# Altium schematic sheet 03_power.SchDoc
size A3
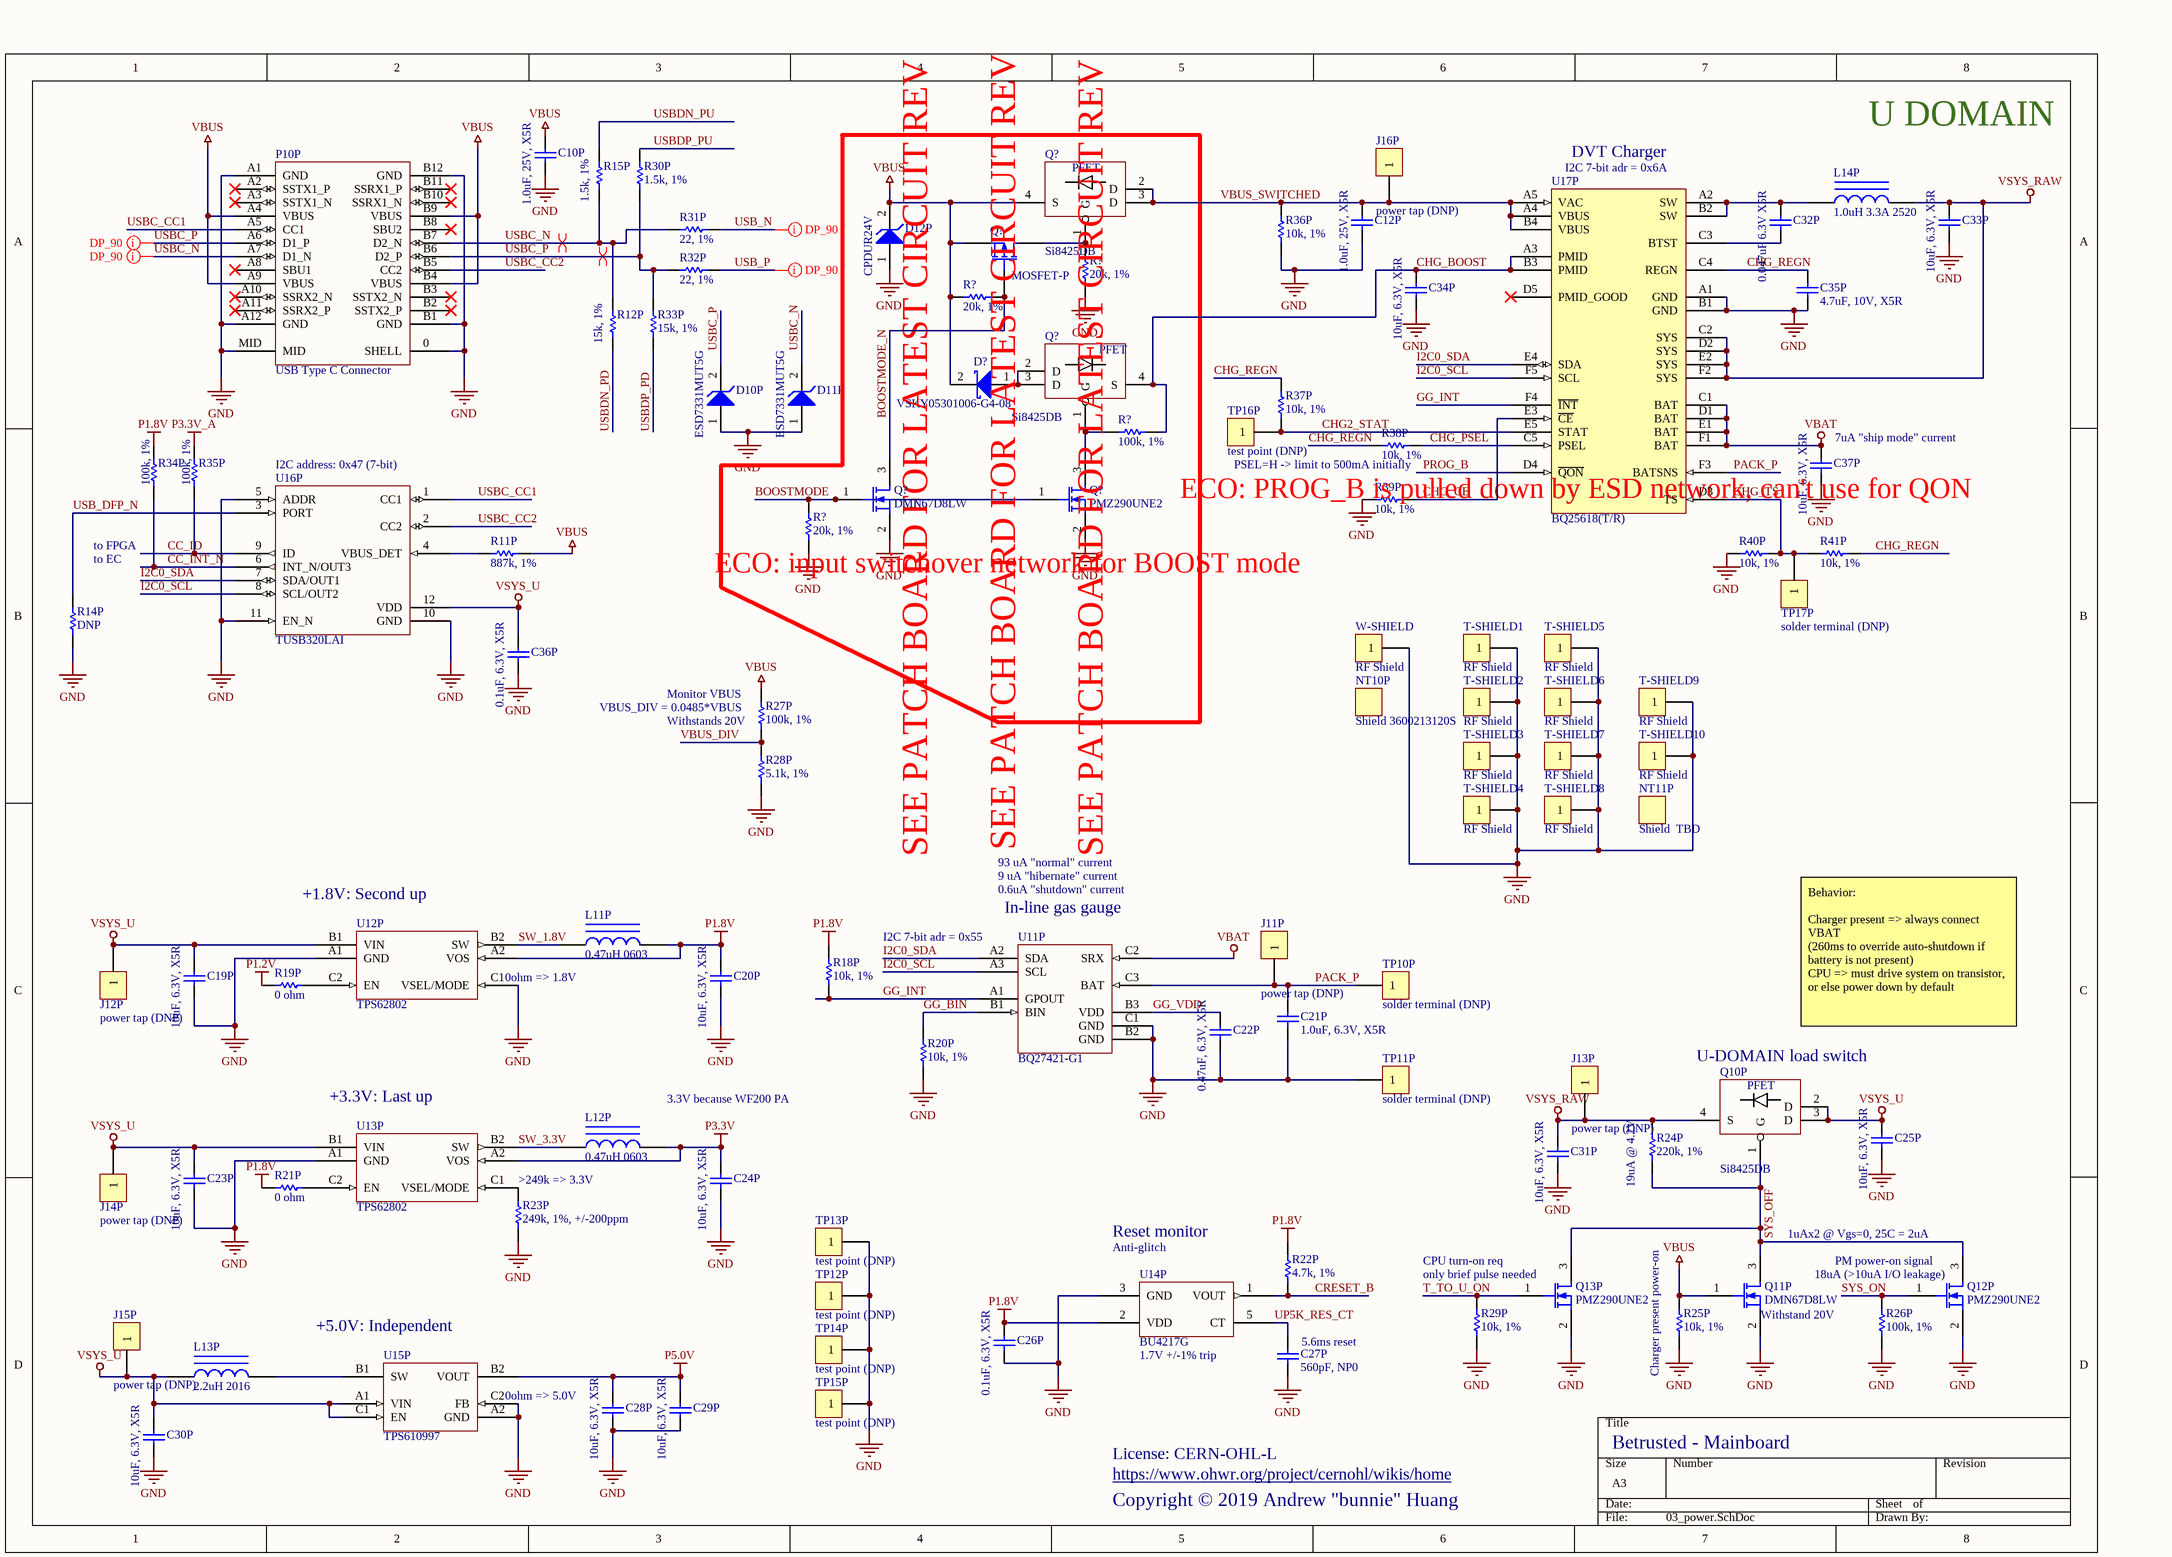
[diagram p0: 03_power.SchDoc]

## Parts
(Parts that share a designator on the sheet are numbered #1, #2 ... from top to bottom, then left to right.)
C10P  1.0uF, 25V, X5R  [B_CAP0603]
C12P  1.0uF, 25V, X5R  [B_CAP0603]
C19P  10uF, 6.3V, X5R  [B_CAP0603]
C20P  10uF, 6.3V, X5R  [B_CAP0603]
C21P  1.0uF, 6.3V, X5R  [B_CAP0201]
C22P  0.47uF, 6.3V, X5R  [B_CAP0201]
C23P  10uF, 6.3V, X5R  [B_CAP0603]
C24P  10uF, 6.3V, X5R  [B_CAP0603]
C25P  10uF, 6.3V, X5R  [B_CAP0603]
C26P  0.1uF, 6.3V, X5R  [B_CAP0201]
C27P  560pF, NP0  [B_RES0201]
C28P  10uF, 6.3V, X5R  [B_CAP0603]
C29P  10uF, 6.3V, X5R  [B_CAP0603]
C30P  10uF, 6.3V, X5R  [B_CAP0603]
C31P  10uF, 6.3V, X5R  [B_CAP0603]
C32P  0.047uF 6.3V X5R  [B_CAP0201]
C33P  10uF, 6.3V, X5R  [B_CAP0603]
C34P  10uF, 6.3V, X5R  [B_CAP0603]
C35P  4.7uF, 10V, X5R  [B_CAP0603]
C36P  0.1uF, 6.3V, X5R  [B_CAP0201]
C37P  10uF, 6.3V, X5R  [B_CAP0603]
D10P  ESD7331MUT5G  [D_X3DFN2_0201]
D11P  ESD7331MUT5G  [D_X3DFN2_0201]
D12P  CPDUR24V  [SOD523]
D?  VSKY05301006-G4-08  [B_DIO0402]
J11P  power tap (DNP)  [RESTAP-0603]
J12P  power tap (DNP)  [RESTAP-0603]
J13P  power tap (DNP)  [RESTAP-0603]
J14P  power tap (DNP)  [RESTAP-0603]
J15P  power tap (DNP)  [RESTAP-0603]
J16P  power tap (DNP)  [RESTAP-0603]
L11P  0.47uH 0603  [B_IND0603]
L12P  0.47uH 0603  [B_IND0603]
L13P  2.2uH 2016  [B_IND2016_TDK]
L14P  1.0uH 3.3A 2520  [B_IND2025_SAM]
NT10P  Shield 3600213120S
NT11P  Shield  TBD
P10P  USB Type C Connector  [TE_1-2295018-2]
Q10P  Si8425DB  [VISHAY_MICRO_FOOT_4_BUMP]
Q11P  DMN67D8LW  [SOT323-3AN]
Q12P  PMZ290UNE2  [SOT883]
Q13P  PMZ290UNE2  [SOT883]
Q?#1  Si8425DB  [VISHAY_MICRO_FOOT_4_BUMP]
Q?#2  MOSFET-P  [E3]
Q?#3  Si8425DB  [VISHAY_MICRO_FOOT_4_BUMP]
Q?#4  DMN67D8LW  [SOT323-3AN]
Q?#5  PMZ290UNE2  [SOT883]
R11P  887k, 1%  [B_RES0201]
R12P  15k, 1%  [B_RES0201]
R14P  DNP  [B_RES0201]
R15P  1.5k, 1%  [B_RES0201]
R18P  10k, 1%  [B_RES0201]
R19P  0 ohm  [B_RES0201]
R20P  10k, 1%  [B_RES0201]
R21P  0 ohm  [B_RES0201]
R22P  4.7k, 1%  [B_RES0201]
R23P  249k, 1%, +/-200ppm  [B_RES0402]
R24P  220k, 1%  [B_RES0201]
R25P  10k, 1%  [B_RES0201]
R26P  100k, 1%  [B_RES0201]
R27P  100k, 1%  [B_RES0201]
R28P  5.1k, 1%  [B_RES0201]
R29P  10k, 1%  [B_RES0201]
R30P  1.5k, 1%  [B_RES0201]
R31P  22, 1%  [B_RES0201]
R32P  22, 1%  [B_RES0201]
R33P  15k, 1%  [B_RES0201]
R34P  100k, 1%  [B_RES0201]
R35P  100k, 1%  [B_RES0201]
R36P  10k, 1%  [B_RES0201]
R37P  10k, 1%  [B_RES0201]
R38P  10k, 1%  [B_RES0201]
R39P  10k, 1%  [B_RES0201]
R40P  10k, 1%  [B_RES0201]
R41P  10k, 1%  [B_RES0201]
R?#1  20k, 1%  [B_RES0201]
R?#2  20k, 1%  [B_RES0201]
R?#3  100k, 1%  [B_RES0201]
R?#4  20k, 1%  [B_RES0201]
T-SHIELD1  RF Shield  [WURTH_36900000]
T-SHIELD2  RF Shield  [WURTH_36900000]
T-SHIELD3  RF Shield  [WURTH_36900000]
T-SHIELD4  RF Shield  [WURTH_36900000]
T-SHIELD5  RF Shield  [WURTH_36900000]
T-SHIELD6  RF Shield  [WURTH_36900000]
T-SHIELD7  RF Shield  [WURTH_36900000]
T-SHIELD8  RF Shield  [WURTH_36900000]
T-SHIELD9  RF Shield  [WURTH_36900000]
T-SHIELD10  RF Shield  [WURTH_36900000]
TP10P  solder terminal (DNP)  [55-MIL-HOLE]
TP11P  solder terminal (DNP)  [55-MIL-HOLE]
TP12P  test point (DNP)  [TP_2MM_SQ]
TP13P  test point (DNP)  [TP_2MM_SQ]
TP14P  test point (DNP)  [TP_2MM_SQ]
TP15P  test point (DNP)  [TP_2MM_SQ]
TP16P  test point (DNP)  [TP_2MM_SQ]
TP17P  solder terminal (DNP)  [55-MIL-HOLE]
U11P  BQ27421-G1  [BGA9C50P3X3_162X158X62]
U12P  TPS62802  [BGA6C35P2X3_70X105X40_NSMD]
U13P  TPS62802  [BGA6C35P2X3_70X105X40_NSMD]
U14P  BU4217G  [SOT23-5AN]
U15P  TPS610997  [BGA6C40P2X3_88X123X62]
U16P  TUSB320LAI  [QFN40P160X160X40-12N]
U17P  BQ25618(T/R)  [BGA30C40P5X6_196X236X62]
W-SHIELD  RF Shield  [WURTH_36X021312XS]

## Blocks framed on the sheet
ECO: PROG_B is pulled down by ESD network, can't use for QON: D12P D? Q?#1-Q?#5 R?#1-R?#4

## Nets
GND: C10P.2 C12P.2 C19P.2 C20P.2 C21P.1 C22P.2 C23P.2 C24P.2 C25P.2 C26P.2 C27P.2 C28P.2 C29P.2 C30P.2 C31P.2 C33P.2 C34P.2 C35P.1 C36P.2 C37P.2 D10P.1(A) D11P.1(A) D12P.1(A) P10P.0(SHELL) P10P.A1(GND) P10P.A12(GND) P10P.B1(GND) P10P.B12(GND) P10P.MID Q11P.2(S) Q12P.2(S) Q13P.2(S) Q?#4.2(S) Q?#5.2(S) R14P.2 R20P.2 R23P.2 R25P.2 R26P.1 R28P.2 R29P.2 R36P.1 R39P.1 R40P.1 R?#1.1 R?#4.1 T-SHIELD1.1 T-SHIELD2.1 T-SHIELD3.1 T-SHIELD4.1 T-SHIELD5.1 T-SHIELD6.1 T-SHIELD7.1 T-SHIELD8.1 T-SHIELD9.1 T-SHIELD10.1 TP11P.1 TP12P.1 TP13P.1 TP14P.1 TP15P.1 U11P.B2(GND) U11P.C1(GND) U12P.A1(GND) U12P.C1(VSEL/MODE) U13P.A1(GND) U14P.3(GND) U15P.A2(GND) U15P.C2(FB) U16P.5(ADDR) U16P.10(GND) U16P.11(EN_N) U17P.A1(GND) U17P.B1(GND) W-SHIELD.1
P1.2V: R19P.1
P1.8V: C20P.1 C26P.1 L11P.2 R18P.1 R21P.1 R22P.2 R34P.2 U12P.A2(VOS) U14P.2(VDD)
P3.3V: C24P.1 L12P.2 U13P.A2(VOS)
P3.3V_A: R35P.2
P5.0V: C28P.1 C29P.1 U15P.B2(VOUT)
VBAT: C37P.1 U11P.C2(SRX) U17P.C1(BAT) U17P.D1(BAT) U17P.E1(BAT) U17P.F1(BAT)
VBUS: C10P.1 D12P.2(K) D?.2(K) P10P.A4(VBUS) P10P.A9(VBUS) P10P.B4(VBUS) P10P.B9(VBUS) Q11P.1(G) Q?#1.4(S) Q?#2.3(S) R11P.1 R25P.1 R27P.2 R?#2.2
VSYS_RAW: C31P.1 C33P.1 J13P.1 L14P.2 Q10P.4(S) R24P.2 U17P.C2(SYS) U17P.D2(SYS) U17P.E2(SYS) U17P.F2(SYS)
VSYS_U: C19P.1 C23P.1 C25P.1 C30P.1 C36P.1 J12P.1 J14P.1 J15P.1 L13P.1 Q10P.2(D) Q10P.3(D) U12P.B1(VIN) U13P.B1(VIN) U15P.A1(VIN) U15P.C1(EN) U16P.12(VDD)
BOOSTMODE: Q?#4.1(G) Q?#5.1(G) R?#4.2
BOOSTMODE_N: Q?#2.2(G) Q?#4.3(D) R?#2.1
CC_ID: R35P.1 U16P.9(ID)
CC_INT_N: R34P.1 U16P.6(INT_N/OUT3)
CHG2_STAT: R37P.2 TP16P.1 U17P.E5(STAT)
CHG_BOOST: C34P.1 Q?#3.4(S) R?#3.1 U17P.A3(PMID) U17P.B3(PMID)
CHG_CE: R39P.2 U17P.E3(~{CE})
CHG_PSEL: R38P.2 U17P.C5(PSEL)
CHG_REGN: C35P.2 R37P.1 R38P.1 R41P.2 U17P.C4(REGN)
CHG_TS: R40P.2 R41P.1 TP17P.1 U17P.D3(TS)
CRESET_B: R22P.1 U14P.1(VOUT)
GG_BIN: R20P.1 U11P.B1(BIN)
GG_INT: R18P.2 U11P.A1(GPOUT) U17P.F4(~{INT})
GG_VDD: C22P.1 U11P.B3(VDD)
I2C0_SCL: U11P.A3(SCL) U16P.8(SCL/OUT2) U17P.F5(SCL)
I2C0_SDA: U11P.A2(SDA) U16P.7(SDA/OUT1) U17P.E4(SDA)
PACK_P: C21P.2 J11P.1 TP10P.1 U11P.C3(BAT) U17P.F3(BATSNS)
PROG_B: U17P.D4(~{QON})
SW_1.8V: L11P.1 U12P.B2(SW)
SW_3.3V: L12P.1 U13P.B2(SW)
SYS_OFF: Q10P.1(G) Q11P.3(D) Q12P.3(D) Q13P.3(D) R24P.1
SYS_ON: Q12P.1(G) R26P.2
T_TO_U_ON: Q13P.1(G) R29P.1
UP5K_RES_CT: C27P.1 U14P.5(CT)
USB_DFP_N: R14P.1 U16P.3(PORT)
USB_N: R31P.2
USB_P: R32P.2
USBC_CC1: P10P.A5(CC1) U16P.1(CC1)
USBC_CC2: P10P.B5(CC2) U16P.2(CC2)
USBC_N: D11P.2(K) P10P.A7(D1_N) P10P.B7(D2_N) R12P.1 R15P.1 R31P.1
USBC_P: D10P.2(K) P10P.A6(D1_P) P10P.B6(D2_P) R30P.1 R32P.1 R33P.1
USBDN_PD: R12P.2
USBDN_PU: R15P.2
USBDP_PD: R33P.2
USBDP_PU: R30P.2
VBUS_DIV: R27P.1 R28P.1
VBUS_SWITCHED: C12P.1 J16P.1 Q?#1.2(D) Q?#1.3(D) R36P.2 U17P.A4(VBUS) U17P.A5(VAC) U17P.B4(VBUS)
NetC32P_1: C32P.1 L14P.1 U17P.A2(SW) U17P.B2(SW)
NetC32P_2: C32P.2 U17P.C3(BTST)
NetD?_1: D?.1(A) Q?#3.2(D) Q?#3.3(D)
NetL13P_2: L13P.2 U15P.B1(SW)
NetQ?#1_1: Q?#1.1(G) Q?#2.1(D) R?#1.2
NetQ?#3_1: Q?#3.1(G) Q?#5.3(D) R?#3.2
NetR11P_2: R11P.2 U16P.4(VBUS_DET)
NetR19P_2: R19P.2 U12P.C2(EN)
NetR21P_2: R21P.2 U13P.C2(EN)
NetR23P_1: R23P.1 U13P.C1(VSEL/MODE)

Not connected (* = marked no-connect by the designer): P10P A2(SSTX1_P)* A3(SSTX1_N)* A8(SBU1)* A10(SSRX2_N)* A11(SSRX2_P)* B2(SSTX2_P)* B3(SSTX2_N)* B8(SBU2)* B10(SSRX1_N)* B11(SSRX1_P)*; U17P D5(PMID_GOOD)*

## Layout directives
differential pair: USBC_N, USBC_P
net class DP_90: USB_N, USB_P, USBC_N, USBC_P

## Notes on the sheet
- (near U17P) DVT Charger
- U DOMAIN
- (near U17P) I2C 7-bit adr = 0x6A
- (near U16P) I2C address: 0x47 (7-bit)
- (near R38P) PSEL=H -> limit to 500mA initially
- (near C37P) 7uA "ship mode" current
- (near R14P) to EC
- to FPGA
- (near R?#4) ECO: input switchover network for BOOST mode
- (near R27P) Monitor VBUS
- (near R27P) VBUS_DIV = 0.0485*VBUS
- (near R27P) Withstands 20V
- (near U12P) +1.8V: Second up
- SEE PATCH BOARD FOR LATEST CIRCUIT REV
- 93 uA "normal" current
- 0.6uA "shutdown" current
- 9 uA "hibernate" current
- (near Q?#1) SEE PATCH BOARD FOR LATEST CIRCUIT REV
- (near U11P) I2C 7-bit adr = 0x55
- (near U11P) In-line gas gauge
- 0ohm => 1.8V
- Behavior:
  Charger present => always connect VBAT
  (260ms to override auto-shutdown if battery is not present)
  CPU => must drive system on transistor, or else power down by default
- (near U13P) +3.3V: Last up
- 3.3V because WF200 PA
- (near Q10P) U-DOMAIN load switch
- (near R23P) >249k => 3.3V
- Reset monitor
- (near R24P) 19uA @ 4.2V
- 1uAx2 @ Vgs=0, 25C = 2uA
- (near U14P) Anti-glitch
- CPU turn-on req
- (near Q13P) only brief pulse needed
- (near Q12P) 18uA (>10uA I/O leakage)
- (near Q12P) PM power-on signal
- (near U15P) +5.0V: Independent
- (near U14P) 1.7V +/-1% trip
- (near C27P) 5.6ms reset
- (near R25P) Charger present power-on
- (near Q11P) Withstand 20V
- 0ohm => 5.0V
- License: CERN-OHL-L
- Copyright © 2019 Andrew "bunnie" Huang
- https://www.ohwr.org/project/cernohl/wikis/home
- Betrusted - Mainboard
- (in symbol Si8425DB) PFET

## Library data of the parts
C10P C12P = Cap Semi: Capacitor (Semiconductor SIM Model); MPN: CL10A105KA8NNNC; VENDOR: Samsung; MYPN: C-105-25-X5R-0603
C19P C20P C23P C24P C25P C28P C29P C30P C31P C33P C34P C37P = Cap Semi: Capacitor (Semiconductor SIM Model); MPN: CL10A106MQ8NNNC; VENDOR: Samsung; MYPN: C-106-6.3-X5R-0603
C21P = Cap Semi: Capacitor (Semiconductor SIM Model); MPN: GRM033R60J105MEA2D; VENDOR: Murata; MYPN: C-105-6p3-X5R-0201
C22P = Cap Semi: Capacitor (Semiconductor SIM Model); MPN: CL03A474KQ3NNNH; VENDOR: Samsung; MYPN: C-474-6p3-X5R-0201
C26P C36P = Cap Semi: Capacitor (Semiconductor SIM Model); MPN: CL03A104KQ3NNNC; VENDOR: Samsung; MYPN: C-104-6p3-X5R-0201
C27P = Cap Semi: Capacitor (Semiconductor SIM Model); MPN: GRM0335C1E561JA01D; VENDOR: Murata; MYPN: C-561-25-NP0-0201
C32P = Cap Semi: Capacitor (Semiconductor SIM Model); MPN: GRM033C81A473KE05D; VENDOR: Murata; MYPN: C-473-10-X6S-0201
C35P = Cap Semi: Capacitor (Semiconductor SIM Model); MPN: CL10A475KP8NNNC; VENDOR: Samsung; MYPN: C-475-10-X5R-0603
D10P D11P = D Zener: VENDOR: ON Semi; MYPN: D-ESD7331MUT5G; Published: 8-Jun-2000; LatestRevisionDate: 17-Jul-2002; LatestRevisionNote: Re-released for DXP Platform.; PackageReference: DIODE-0.7; Publisher: Altium Limited; PackageDescription: Diode, Thru-Hole; 2 Leads; 0.7 in Pin Spacing; MPN: ESD7331MUT5G
D12P = D Zener: VENDOR: Comchip Technology; MYPN: D-CPDUR24V; Published: 8-Jun-2000; LatestRevisionDate: 17-Jul-2002; LatestRevisionNote: Re-released for DXP Platform.; PackageReference: DIODE-0.7; Publisher: Altium Limited; PackageDescription: Diode, Thru-Hole; 2 Leads; 0.7 in Pin Spacing; MPN: CPDUR24V
D? = Diode 11DQ03: Schottky Rectifier; MYPN: D-SCHOTTKY-0402-CSP; VENDOR: Vishay; ComponentLink1Description: Manufacturer Link; ComponentLink1URL: http://www.irf.com/; ComponentLink2Description: Datasheet; ComponentLink2URL: http://www.irf.com/product-info/datasheets/data/11dq03.pdf; MPN: VSKY05301006-G4-08
J11P J12P J13P J14P J15P J16P = CON1: Connector; MYPN: J-TP-PWRTAP-0603; MPN: DNP; VENDOR: DNP
L11P L12P = Inductor Iron: Magnetic-Core Inductor; MPN: TFM160808ALC-R47MTAA; VENDOR: TDK; MYPN: L-TFM160808ALC-R47MTAA
L13P = Inductor Iron: Magnetic-Core Inductor; MPN: VLS201610CX-2R2M-1; VENDOR: TDK; MYPN: L-VLS201610CX-2R2M-1
L14P = Inductor Iron: Magnetic-Core Inductor; MPN: CIGW252010GL1R0MNE; VENDOR: Samsung; MYPN: L-CIGW252010GL1R0MNE
NT10P = NOTE: RF Shield snap-on; MYPN: NT-3600213120S; VENDOR: Wurth; MPN: 3600213120S
NT11P = NOTE: RF Shield snap-on; VENDOR: Placeholder; MPN: TBD; MYPN: TBD
P10P = USB_TYPE_C: MPN: 1-2295018-2; VENDOR: TE Connectivity AMP Connectors; MYPN: P-1-2295018-2
Q10P Q?#1 Q?#3 = Si8425DB: P-channel 20V 6.2A 27mOhm @ -2.5V; MPN: SI8457DB-T1-E1; VENDOR: Vishay Siliconix; MYPN: Q-Si8457
Q11P Q?#4 = MOSFET-N: N-Channel MOSFET; VENDOR: Diodes Inc; MYPN: Q-DMN67D8LW; Published: 8-Jun-2000; LatestRevisionDate: 17-Jul-2002; LatestRevisionNote: Re-released for DXP Platform.; PackageVersion: 1995/1996; PackageReference: E3; Publisher: Altium Limited; MPN: DMN67D8LW
Q12P Q13P Q?#5 = MOSFET-N: N-Channel MOSFET; VENDOR: Nexperia; MYPN: Q-PMZ290UNE2; Published: 8-Jun-2000; LatestRevisionDate: 17-Jul-2002; LatestRevisionNote: Re-released for DXP Platform.; PackageVersion: 1995/1996; PackageReference: E3; Publisher: Altium Limited; MPN: PMZ290UNE2
Q?#2 = MOSFET-P: P-Channel MOSFET; Published: 8-Jun-2000; LatestRevisionDate: 17-Jul-2002; LatestRevisionNote: Re-released for DXP Platform.; PackageVersion: 1995/1996; PackageReference: E3; Publisher: Altium Limited; PackageDescription: TO, Flat Index; 3 In-Line, Axial Leads; Body Dia. 4.6mm; Lead Dia. 0.5 mm (max)
R11P = Res1: Resistor; VENDOR: ANY; MYPN: R-8873-1P-1_16W-0201; MPN: ANY
R12P R33P = Res1: Resistor; VENDOR: ANY; MYPN: R-153-1P-1_16W-0201; MPN: ANY
R14P = Res1: Resistor; VENDOR: ANY; MYPN: DNP; MPN: ANY
R15P R30P = Res1: Resistor; VENDOR: ANY; MYPN: R-152-1P-1_16W-0201; MPN: ANY
R18P R20P R25P R29P R36P R37P R38P R39P R40P R41P = Res1: Resistor; VENDOR: ANY; MYPN: R-103-1P-1_16W-0201; MPN: ANY
R19P R21P = Res1: Resistor; VENDOR: ANY; MYPN: R-0R0-1P-1_16W-0201; MPN: ANY
R22P = Res1: Resistor; VENDOR: ANY; MYPN: R-472-1P-1_16W-0201; MPN: ANY
R23P = Res1: Resistor; MPN: RC0402FR-07249KL; VENDOR: Yageo; MYPN: R-2493-1P-1_16W-0402
R24P = Res1: Resistor; VENDOR: ANY; MYPN: R-224-1P-1_16W-0201; MPN: ANY
R26P R27P R34P R35P R?#3 = Res1: Resistor; VENDOR: ANY; MYPN: R-104-1P-1_16W-0201; MPN: ANY
R28P = Res1: Resistor; VENDOR: ANY; MYPN: R-512-1P-1_16W-0201; MPN: ANY
R31P R32P = Res1: Resistor; VENDOR: ANY; MYPN: R-220-1P-1_16W-0201; MPN: ANY
R?#1 R?#2 R?#4 = Res1: Resistor; VENDOR: ANY; MYPN: R-203-1P-1_16W-0201; MPN: ANY
T-SHIELD1-T-SHIELD10 = CON1: Connector; MPN: 36900000; MYPN: J-36900000; VENDOR: Wurth
TP10P TP11P TP12P TP13P TP14P TP15P TP16P TP17P = CON1: Connector; MYPN: Built into PCB; MPN: DNP; VENDOR: DNP
U11P = BQ27421-G1: System-Side Impedance Track Fuel Gauge with integrated Sense Resistor; MPN: bq27421YZFT-G1A; VENDOR: TI; MYPN: bq27421YZF(T/R)-G1A
U12P U13P = TPS62802: Buck regulator, 4MHz, 0.6A, 1.8V-3.3V, low Iq; MPN: TPS62802YKAR; VENDOR: TI; MYPN: U-TPS62802YKA(T/R)
U14P = BU42XXG: Low voltage free delay time setting CMOS voltage detector IC; MPN: BU4217G-TR; MYPN: U-BU4217G-TR; VENDOR: Rohm
U15P = TPS610997: Synchronous Boost Converter with Ultra-Low Iq; MPN: TPS610997YFFR; VENDOR: TI; MYPN: TPS610997YFFT(T/R)
U16P = TUSB320LAI: USB Type-C Configuration Channel Logic and Port Control; VENDOR: TI; MYPN: U-TUSB320LAI; MPN: TUSB320LAI
U17P = BQ25618: I2C controlled 1-cell 1.5A battery charger with 20mA termination and 1A boost operation; MPN: BQ25618YFFT; VENDOR: TI; MYPN: U-BQ25618YFF(T/R)
W-SHIELD = CON1: Connector; MPN: 3610213126S; VENDOR: Wurth; MYPN: 3610213126S